# Altium project Medusa_9x8.PrjPcb
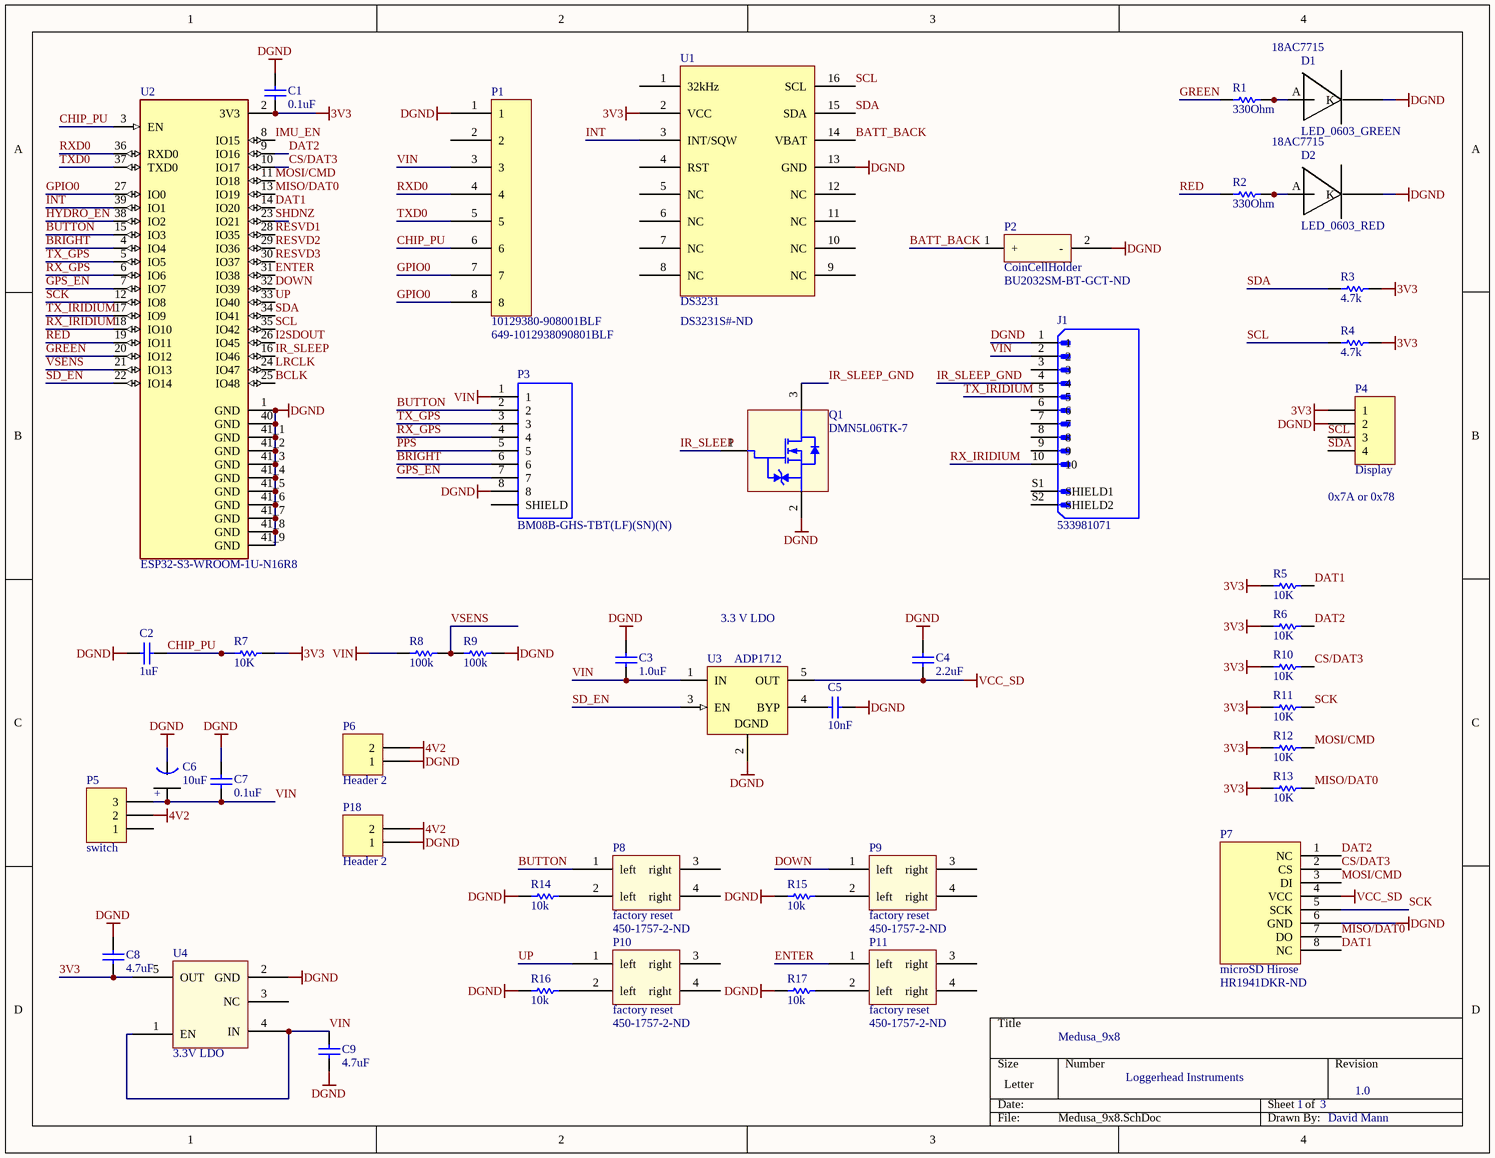
[diagram p0: Medusa_9x8.SchDoc]
2 sheets, 74 parts. Net scope: global (net labels, ports and power ports of the same name join across sheets).
Board file: Medusa_9x8.PcbDoc
Sheets:
  Medusa_9x8.SchDoc
  Medusa_9x8_audio.SchDoc

## Sheet Medusa_9x8.SchDoc
size Letter; SheetNumber: 1; SheetTotal: 2

### Parts
C1  0.1uF  [0402]
C2  1uF  [0402]
C3  1.0uF  [0402]
C4  2.2uF  [0402]
C5  10nF  [0402]
C6  10uF  [Tant0805]
C7  0.1uF  [0402]
C8  4.7uF  [0402]
C9  4.7uF  [0402]
D1  LED_0603_GREEN  Supplier Part Number 1: 18AC7715  [Diode0603]
D2  LED_0603_RED  Supplier Part Number 1: 18AC7715  [Diode0603]
J1  533981071  [MOLEX_533981071]
P1  10129380-908001BLF  Supplier Part Number 1: 649-1012938090801BLF  [Header_8_SMT]
P2  CoinCellHolder  Supplier Part Number 1: BU2032SM-BT-GCT-ND  [CoinCellHolder]
P3  BM08B-GHS-TBT(LF)(SN)(N)  [JST_BM08B-GHS-TBT(LF)(SN)(N)]
P4  Display  [HDR1X4]
P5  switch  [HDR1X3]
P6  Header 2  [HDR1X2]
P7  microSD Hirose  Supplier Part Number 1: HR1941DKR-ND  [DM3D microSD]
P8  factory reset  Supplier Part Number 1: 450-1757-2-ND  [SOP4]
P9  factory reset  Supplier Part Number 1: 450-1757-2-ND  [SOP4]
P10  factory reset  Supplier Part Number 1: 450-1757-2-ND  [SOP4]
P11  factory reset  Supplier Part Number 1: 450-1757-2-ND  [SOP4]
P18  Header 2  [HDR1X2]
Q1  DMN5L06TK-7  [SOT-523]
R1  330Ohm  [2-0402]
R2  330Ohm  [2-0402]
R3  4.7k  [2-0402]
R4  4.7k  [2-0402]
R5  10K  [2-0402]
R6  10K  [2-0402]
R7  10K  [2-0402]
R8  100k  [2-0402]
R9  100k  [2-0402]
R10  10K  [2-0402]
R11  10K  [2-0402]
R12  10K  [2-0402]
R13  10K  [2-0402]
R14  10k  [2-0402]
R15  10k  [2-0402]
R16  10k  [2-0402]
R17  10k  [2-0402]
U1  DS3231  Supplier Part Number 1: DS3231S#-ND  [DS3231]
U2  ESP32-S3-WROOM-1U-N16R8  [XCVR_ESP32-S3-WROOM-1U-N16R8]
U3  ADP1712  [MF05A_N]
U4  3.3V LDO  [AP7361C-33Y5-13]

### Nets
3V3: C1.1 C8.2 P4.1 R3.1 R4.1 R5.2 R6.2 R7.1 R10.2 R11.2 R12.2 R13.2 U1.2(VCC) U2.2(3V3) U4.5(OUT)
4V2: P5.2 P6.2 P18.2
DGND: C1.2 C2.2 C3.2 C4.2 C5.1 C6.1(GND) C7.2 C8.1 C9.2 D1.K D2.K J1.1 P1.1 P2.2(-) P3.8 P4.2 P6.1 P7.6(GND) P18.1 Q1.2(S) R9.1 R14.2 R15.2 R16.2 R17.2 U1.13(GND) U2.1(GND) U2.40(GND) U2.41_1(GND) U2.41_2(GND) U2.41_3(GND) U2.41_4(GND) U2.41_5(GND) U2.41_6(GND) U2.41_7(GND) U2.41_8(GND) U2.41_9(GND) U3.2(GND) U4.2(GND)
VCC_SD: C4.1 P7.4(VCC) U3.5(OUT)
VIN: C3.1 C6.2(+) C7.1 C9.1 J1.2 P1.3 P3.1 P5.3 R8.2 U3.1(IN) U4.1(EN) U4.4(IN)
BATT_BACK: P2.1(+) U1.14(VBAT)
BCLK: U2.25(IO48)
BRIGHT: P3.6 U2.4(IO4)
BUTTON: P3.2 P8.1(left) U2.15(IO3)
CHIP_PU: C2.1 P1.6 R7.2 U2.3(EN)
CS/DAT3: P7.2(CS) R10.1 U2.10(IO17)
DAT1: P7.8(NC) R5.1 U2.14(IO20)
DAT2: P7.1(NC) R6.1 U2.9(IO16)
DOWN: P9.1(left) U2.32(IO39)
ENTER: P11.1(left) U2.31(IO38)
GPIO0: P1.7 P1.8 U2.27(IO0)
GPS_EN: P3.7 U2.7(IO7)
GREEN: R1.2 U2.20(IO12)
HYDRO_EN: U2.38(IO2)
I2SDOUT: U2.26(IO45)
IMU_EN: U2.8(IO15)
INT: U1.3(INT/SQW) U2.39(IO1)
IR_SLEEP: Q1.1(G) U2.16(IO46)
IR_SLEEP_GND: J1.4 Q1.3(D)
LRCLK: U2.24(IO47)
MISO/DAT0: P7.7(DO) R13.1 U2.13(IO19)
MOSI/CMD: P7.3(DI) R12.1 U2.11(IO18)
PPS: P3.5
RED: R2.2 U2.19(IO11)
RESVD1: U2.28(IO35)
RESVD2: U2.29(IO36)
RESVD3: U2.30(IO37)
RX_GPS: P3.4 U2.6(IO6)
RX_IRIDIUM: J1.10 U2.18(IO10)
RXD0: P1.4 U2.36(RXD0)
SCK: P7.5(SCK) R11.1 U2.12(IO8)
SCL: P4.3 R4.2 U1.16(SCL) U2.35(IO42)
SD_EN: U2.22(IO14) U3.3(EN)
SDA: P4.4 R3.2 U1.15(SDA) U2.34(IO41)
SHDNZ: U2.23(IO21)
TX_GPS: P3.3 U2.5(IO5)
TX_IRIDIUM: J1.5 U2.17(IO9)
TXD0: P1.5 U2.37(TXD0)
UP: P10.1(left) U2.33(IO40)
VSENS: R8.1 R9.2 U2.21(IO13)
NetC5_2: C5.2 U3.4(BYP)
NetD1_A: D1.A R1.1
NetD2_A: D2.A R2.1
NetP3_P1: P3.P1(SHIELD) P3.P2(SHIELD)
NetP8_2: P8.2(left) R14.1
NetP9_2: P9.2(left) R15.1
NetP10_2: P10.2(left) R16.1
NetP11_2: P11.2(left) R17.1

Not connected (* = marked no-connect by the designer): J1 3 6 7 8 9 S1(SHIELD1) S2(SHIELD2); P1 2; P5 1; P8 3(right) 4(right); P9 3(right) 4(right); P10 3(right) 4(right); P11 3(right) 4(right); U1 1(32kHz) 4(RST) 5(NC) 6(NC) 7(NC) 8(NC) 9(NC) 10(NC) 11(NC) 12(NC); U4 3(NC)

### Notes on the sheet
- (near P4) 0x7A or 0x78
- 3.3 V LDO
- Medusa_9x8
- Loggerhead Instruments
- 1
- 3
- 1.0
- David Mann
- (in symbol LP3985IM5-3.3) DGND

### Library data of the parts
C1 C7 = C0402: Ceramic Chip Capacitor - Standard; Note: Footprint corresponds to dimensions for bulk cassette packaging. This case size has tightened tolerances.; Published: 17-Jul-2002; LatestRevisionDate: 19-Mar-2004; LatestRevisionNote: Silkscreen size reduced.; DatasheetDocument: Mar-2001; PackageDocument: Mar-2001; PackageReference: 0402; Publisher: Altium Limited; Code_JEITA: 0402; Code_IPC: 1005 [0402]; ComponentLink1Description: Manufacturer Link; ComponentLink1URL: http://www.kemet.com/; ComponentLink2Description: Datasheet; ComponentLink2URL: http://www.kemet.com/kemet/web/homepage/kechome.nsf/vapubfilesname/F3102TA.pdf/$file/F3102TA.pdf; Value: 0.1uF
C2-C5 C8 C9 = C0402: Ceramic Chip Capacitor - Standard; Note: Footprint corresponds to dimensions for bulk cassette packaging. This case size has tightened tolerances.; Value: 0.1uF; Published: 17-Jul-2002; LatestRevisionDate: 19-Mar-2004; LatestRevisionNote: Silkscreen size reduced.; DatasheetDocument: Mar-2001; PackageDocument: Mar-2001; PackageReference: 0402; Publisher: Altium Limited; Code_JEITA: 0402; Code_IPC: 1005 [0402]; ComponentLink1Description: Manufacturer Link; ComponentLink1URL: http://www.kemet.com/; ComponentLink2Description: Datasheet; ComponentLink2URL: http://www.kemet.com/kemet/web/homepage/kechome.nsf/vapubfilesname/F3102TA.pdf/$file/F3102TA.pdf
C6 = Tant0805: Value: 10uF
D1 D2 = LED_0603: Supplier 1: Newark
P1 = Header8_SMT: Surface mount header; Supplier 1: Mouser
P3 = BM08B-GHS-TBT(LF)(SN)(N): Connector Header Surface Mount 8 position 0.049 _1.25mm_; MF: JST Sales; MP: BM08B-GHS-TBT_LF__SN__N_; Package: None; Value: *; Price: None; SnapEDA_Link: https://www.snapeda.com/parts/BM08B-GHS-TBT%28LF%29%28SN%29%28N%29/JST%20Sales%20America%20Inc./view-part/568692/?ref=snap; Availability: Unavailable
P4 = Header 4: Header, 4-Pin; LatestRevisionDate: 17-Jul-2002; LatestRevisionNote: Re-released for DXP Platform.; Publisher: Altium Limited
P5 = Header 3: Header, 3-Pin; LatestRevisionDate: 17-Jul-2002; LatestRevisionNote: Re-released for DXP Platform.; Publisher: Altium Limited
P6 P18 = Header 2: Header, 2-Pin; LatestRevisionDate: 17-Jul-2002; LatestRevisionNote: Re-released for DXP Platform.; Publisher: Altium Limited
P8-P11 = pushbutton: Supplier 1: Digi-Key
Q1 = FET DMN5L06TK-7: Ultra-low leakage Enhanced MOSFET; Fabrication Tested: NO; Creator and Date: Will Flanery 2010-09-02; Footprint Verified By: *; Schematic Verified By: *; Vendor Info Verified By: *; Supplier 1: Digi-Key; Supplier Part Number 1: DMN5L06TKDICT-ND; HelpURL: http://www.diodes.com/datasheets/ds30926.pdf
R1-R17 = ERJ2RB: Precision Thick Film Chip Resistor, 10 Ohm to 1M Ohm Range, 1% and 0.5% Tolerance, 0402 Size, 0.063 W; Published: 17-Dec-2003; LatestRevisionDate: 19-Mar-2004; LatestRevisionNote: Silkscreen size reduced.; PackageDocument: Mar-2003; PackageReference: 2-0402; Publisher: Altium Limited; Code_IPC: 1005 [0402]; ComponentLink1Description: Manufacturer Link; ComponentLink1URL: http://www.panasonic.com/industrial/components/resistive_products.htm; ComponentLink2Description: Datasheet; ComponentLink2URL: http://www.panasonic.com/industrial/components/pdf/AOA0000CE2.pdf
U2 = ESP32-S3-WROOM-1U-N16R8: Bluetooth, WiFi 802.11b/g/n, Bluetooth v5.0 Transceiver Module 2.4GHz Antenna Not Included, U.FL Surface Mount; MF: Espressif Systems; Package: None; Price: None; Value: *; SnapEDA_Link: https://www.snapeda.com/parts/ESP32-S3-WROOM-1U-N16R8/Espressif+Systems/view-part/?ref=snap; MP: ESP32-S3-WROOM-1U-N16R8; Availability: Unavailable; Check_prices: https://www.snapeda.com/parts/ESP32-S3-WROOM-1U-N16R8/Espressif+Systems/view-part/?ref=eda
U3 = LP3985IM5-3.3: Micropower, 150mA Low-Noise Ultra Low-Dropout CMOS Voltage Regulator; Manufacturer: National Semiconductor; CompType: LDO IC; PackageTopMarking: LDQB*XTT; PowerWise: N; Published: 4-Dec-2008; DatasheetVersion: Aug-2005; PackageVersion: revD, Aug-2008; PackageReference: MF05A; Publisher: Altium Limited; PackageDescription: Molded SOT-23, .115 x .063 x .040 in Body, 5 Lead, .0375 in Pitch; PartNumber: LP3985IM5-3.3; RoHS: O; PinCount: 5; DigiKeyPartNumber: LP3985IM5-3.3CT-ND; ComponentLink1Description: LP3985 Datasheet; ComponentLink1URL: http://www.national.com/ds/LP/LP3985.pdf; ComponentLink2Description: LP3985 Web Page; ComponentLink2URL: http://www.national.com/pf/LP/LP3985.html; ComponentLink3Description: MF05A Package Page; ComponentLink3URL: http://www.national.com/packaging/folders/mf05a.html
U4 = AP7361C-33Y5-13
J1 = 533981071: Package: None; MP: 533981071; Availability: Unavailable; Price: None; Value: *
P2 = CoinCellHolder: Supplier 1: Digi-Key
P7 = microSD Hirose: Supplier 1: Digi-Key
U1 = DS3231: Supplier 1: Digi-Key

## Sheet Medusa_9x8_audio.SchDoc
size Letter; SheetNumber: 2; SheetTotal: 2
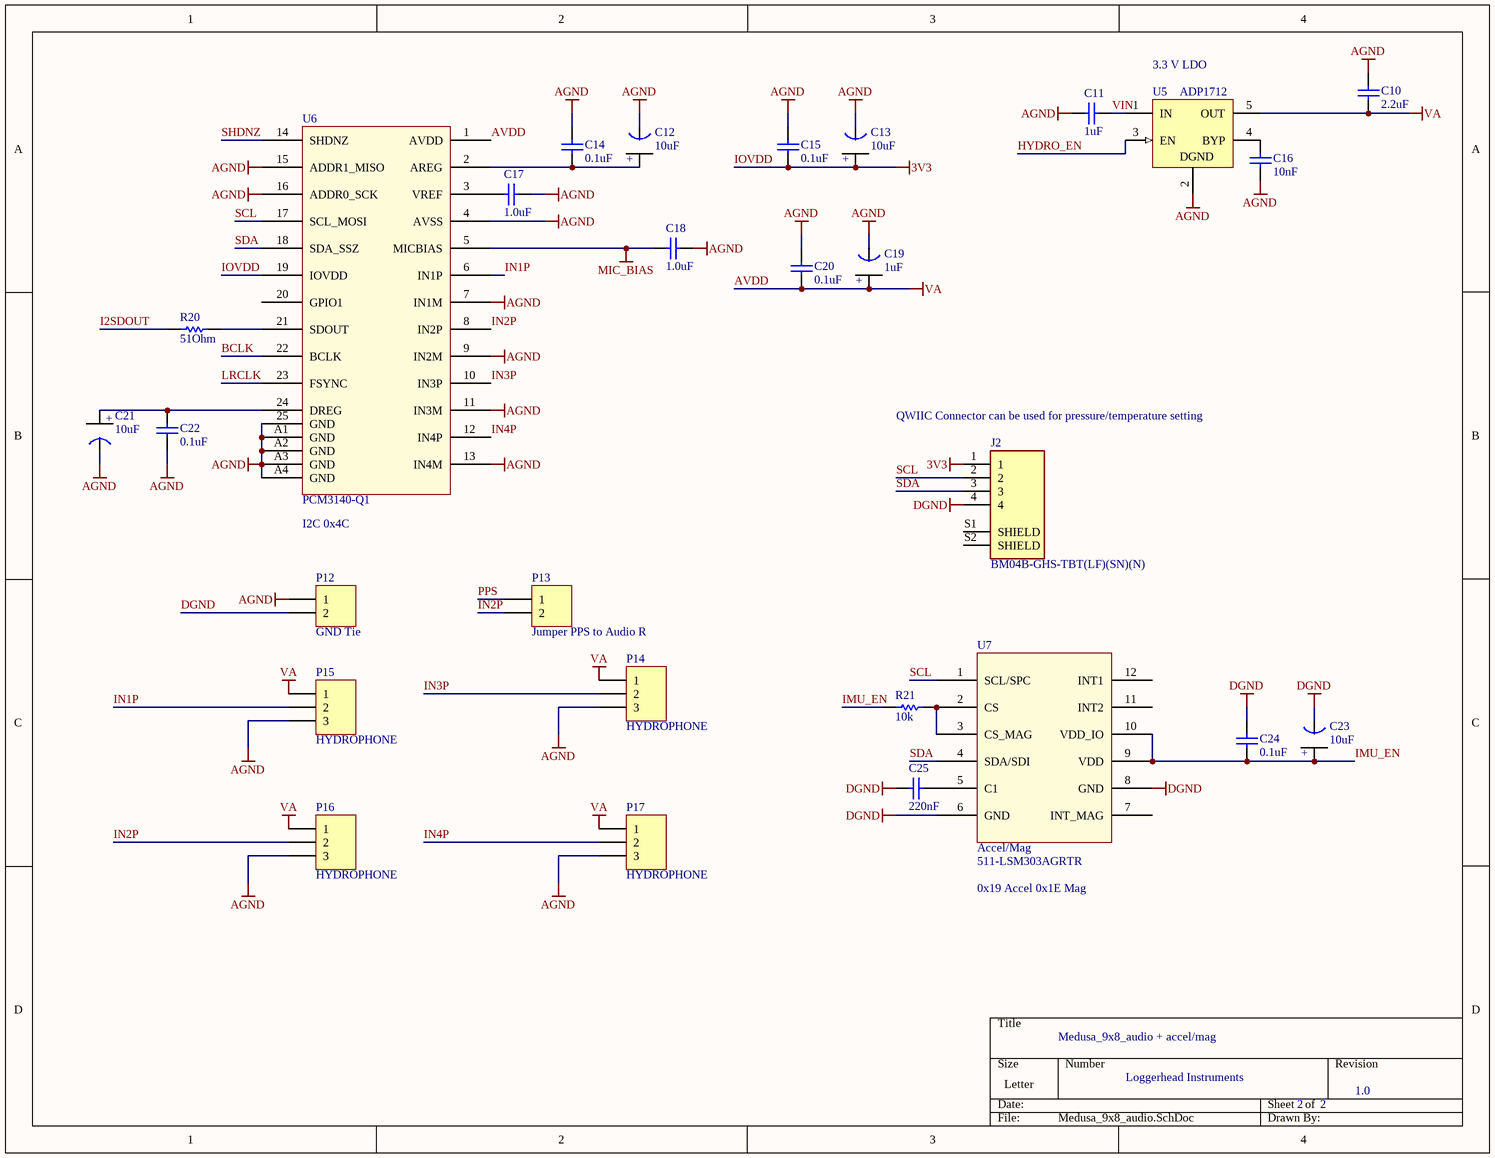
[diagram p1: Medusa_9x8_audio.SchDoc]

### Parts
C10  2.2uF  [0402]
C11  1uF  [0402]
C12  10uF  [Tant0805]
C13  10uF  [Tant0805]
C14  0.1uF  [0402]
C15  0.1uF  [0402]
C16  10nF  [0402]
C17  1.0uF  [0402]
C18  1.0uF  [0402]
C19  1uF  [Tant0805]
C20  0.1uF  [0402]
C21  10uF  [Tant0805]
C22  0.1uF  [0402]
C23  10uF  [Tant0805]
C24  0.1uF  [0402]
C25  220nF  [0402]
J2  BM04B-GHS-TBT(LF)(SN)(N)  [JST_BM04B-GHS-TBT(LF)(SN)(N)]
P12  GND Tie  [HDR1X2]
P13  Jumper PPS to Audio R  [HDR1X2]
P14  HYDROPHONE  [HDR1X3]
P15  HYDROPHONE  [HDR1X3]
P16  HYDROPHONE  [HDR1X3]
P17  HYDROPHONE  [HDR1X3]
R20  51Ohm  [2-0402]
R21  10k  [2-0402]
U5  ADP1712  [MF05A_N]
U6  PCM3140-Q1  [PCM3140]
U7  Accel/Mag  Supplier Part Number 1: 511-LSM303AGRTR  [LGA-12]

### Nets
3V3: C13.2(+) C15.2 J2.1 U6.19(IOVDD)  [also labelled IOVDD]
AGND: C10.2 C11.2 C12.1(GND) C13.1(GND) C14.1 C15.1 C16.2 C17.1 C18.1 C19.1(GND) C20.1 C21.1(GND) C22.1 P12.1 P14.3 P15.3 P16.3 P17.3 U5.2(GND) U6.4(AVSS) U6.7(IN1M) U6.9(IN2M) U6.11(IN3M) U6.13(IN4M) U6.15(ADDR1_MISO) U6.16(ADDR0_SCK) U6.25(GND) U6.A1(GND) U6.A2(GND) U6.A3(GND) U6.A4(GND)
AVDD: C10.1 C19.2(+) C20.2 P14.1 P15.1 P16.1 P17.1 U5.5(OUT) U6.1(AVDD)  [also labelled VA]
DGND: C23.1(GND) C24.2 C25.1 J2.4 P12.2 U7.6(GND) U7.8(GND)
MIC_BIAS: C18.2 U6.5(MICBIAS)
VIN: C11.1 U5.1(IN)
BCLK: U6.22(BCLK)
HYDRO_EN: U5.3(EN)
I2SDOUT: R20.1
IMU_EN: C23.2(+) C24.1 R21.2 U7.9(VDD) U7.10(VDD_IO)
IN1P: P15.2 U6.6(IN1P)
IN2P: P13.2 P16.2 U6.8(IN2P)
IN3P: P14.2 U6.10(IN3P)
IN4P: P17.2 U6.12(IN4P)
LRCLK: U6.23(FSYNC)
PPS: P13.1
SCL: J2.2 U6.17(SCL_MOSI) U7.1(SCL/SPC)
SDA: J2.3 U6.18(SDA_SSZ) U7.4(SDA/SDI)
SHDNZ: U6.14(SHDNZ)
NetC12_2: C12.2(+) C14.2 U6.2(AREG)
NetC16_1: C16.1 U5.4(BYP)
NetC17_2: C17.2 U6.3(VREF)
NetC21_2: C21.2(+) C22.2 U6.24(DREG)
NetC25_2: C25.2 U7.5(C1)
NetR20_2: R20.2 U6.21(SDOUT)
NetR21_1: R21.1 U7.2(CS) U7.3(CS_MAG)

Not connected (* = marked no-connect by the designer): J2 S1(SHIELD) S2(SHIELD); U6 20(GPIO1); U7 7(INT_MAG) 11(INT2) 12(INT1)

### Notes on the sheet
- (near U5) 3.3 V LDO
- (near J2) QWIIC Connector can be used for pressure/temperature setting
- (near U6) I2C 0x4C
- 0x19 Accel 0x1E Mag
- Medusa_9x8_audio + accel/mag
- Loggerhead Instruments
- 2
- 1.0
- (in symbol LP3985IM5-3.3) DGND

### Library data of the parts
C10 C11 C16-C18 C25 = C0402: as C2 on sheet Medusa_9x8; Published: 17-Jul-2002; LatestRevisionDate: 19-Mar-2004; LatestRevisionNote: Silkscreen size reduced.; DatasheetDocument: Mar-2001; PackageDocument: Mar-2001; PackageReference: 0402; Publisher: Altium Limited; Code_JEITA: 0402; Code_IPC: 1005 [0402]; ComponentLink1Description: Manufacturer Link; ComponentLink1URL: http://www.kemet.com/; ComponentLink2Description: Datasheet; ComponentLink2URL: http://www.kemet.com/kemet/web/homepage/kechome.nsf/vapubfilesname/F3102TA.pdf/$file/F3102TA.pdf
C12 C13 C21 C23 = Tant0805: Value: 10uF
C14 C15 C20 C22 C24 = C0402: as C1 on sheet Medusa_9x8; Published: 17-Jul-2002; LatestRevisionDate: 19-Mar-2004; LatestRevisionNote: Silkscreen size reduced.; DatasheetDocument: Mar-2001; PackageDocument: Mar-2001; PackageReference: 0402; Publisher: Altium Limited; Code_JEITA: 0402; Code_IPC: 1005 [0402]; ComponentLink1Description: Manufacturer Link; ComponentLink1URL: http://www.kemet.com/; ComponentLink2Description: Datasheet; ComponentLink2URL: http://www.kemet.com/kemet/web/homepage/kechome.nsf/vapubfilesname/F3102TA.pdf/$file/F3102TA.pdf; Value: 0.1uF
C19 = Tant0805: Value: 10uF
J2 = BM04B-GHS-TBT(LF)(SN)(N): Connector Header Surface Mount 4 position 0.049 _1.25mm_; MF: JST Sales; MP: BM04B-GHS-TBT_LF__SN__N_; SnapEDA_Link: https://www.snapeda.com/parts/BM04B-GHS-TBT%28LF%29%28SN%29%28N%29/JST%20Sales%20America%20Inc./view-part/841999/?ref=snap; Digi-Key_Part_Number: 455-1580-1-ND; Digi-Key_Purchase_URL: https://www.digikey.com/product-detail/en/jst-sales-america-inc/BM04B-GHS-TBT_LF__SN__N_/455-1580-1-ND/807848?utm_source=snapeda&utm_medium=aggregator&utm_campaign=symbol; Value: *; Package: None
P12 P13 = Header 2: Header, 2-Pin; LatestRevisionDate: 17-Jul-2002; LatestRevisionNote: Re-released for DXP Platform.; Publisher: Altium Limited
P14-P17 = Header 3: Header, 3-Pin; LatestRevisionDate: 17-Jul-2002; LatestRevisionNote: Re-released for DXP Platform.; Publisher: Altium Limited
R20 R21 = ERJ2RB: as R1 on sheet Medusa_9x8; Published: 17-Dec-2003; LatestRevisionDate: 19-Mar-2004; LatestRevisionNote: Silkscreen size reduced.; PackageDocument: Mar-2003; PackageReference: 2-0402; Publisher: Altium Limited; Code_IPC: 1005 [0402]; ComponentLink1Description: Manufacturer Link; ComponentLink1URL: http://www.panasonic.com/industrial/components/resistive_products.htm; ComponentLink2Description: Datasheet; ComponentLink2URL: http://www.panasonic.com/industrial/components/pdf/AOA0000CE2.pdf
U5 = LP3985IM5-3.3: as U3 on sheet Medusa_9x8; Published: 4-Dec-2008; DatasheetVersion: Aug-2005; PackageVersion: revD, Aug-2008; PackageReference: MF05A; Publisher: Altium Limited; PackageDescription: Molded SOT-23, .115 x .063 x .040 in Body, 5 Lead, .0375 in Pitch; PartNumber: LP3985IM5-3.3; RoHS: O; PinCount: 5; DigiKeyPartNumber: LP3985IM5-3.3CT-ND; ComponentLink1Description: LP3985 Datasheet; ComponentLink1URL: http://www.national.com/ds/LP/LP3985.pdf; ComponentLink2Description: LP3985 Web Page; ComponentLink2URL: http://www.national.com/pf/LP/LP3985.html; ComponentLink3Description: MF05A Package Page; ComponentLink3URL: http://www.national.com/packaging/folders/mf05a.html
U7 = LSM303AGR: Supplier 1: Mouser

## Nets that join several sheets
3V3: Medusa_9x8 (15 pins), Medusa_9x8_audio (C13.2 C15.2 J2.1 U6.19)
DGND: Medusa_9x8 (39 pins), Medusa_9x8_audio (7 pins)
VIN: Medusa_9x8 (12 pins), Medusa_9x8_audio (C11.1 U5.1)
BCLK: Medusa_9x8 (U2.25), Medusa_9x8_audio (U6.22)
HYDRO_EN: Medusa_9x8 (U2.38), Medusa_9x8_audio (U5.3)
I2SDOUT: Medusa_9x8 (U2.26), Medusa_9x8_audio (R20.1)
IMU_EN: Medusa_9x8 (U2.8), Medusa_9x8_audio (5 pins)
LRCLK: Medusa_9x8 (U2.24), Medusa_9x8_audio (U6.23)
PPS: Medusa_9x8 (P3.5), Medusa_9x8_audio (P13.1)
SCL: Medusa_9x8 (P4.3 R4.2 U1.16 U2.35), Medusa_9x8_audio (J2.2 U6.17 U7.1)
SDA: Medusa_9x8 (P4.4 R3.2 U1.15 U2.34), Medusa_9x8_audio (J2.3 U6.18 U7.4)
SHDNZ: Medusa_9x8 (U2.23), Medusa_9x8_audio (U6.14)